# Altium schematic sheet LaunchPad_TargetDevice.SchDoc
size 431 x 279 mm; Date: Not shown in title block; ApprovedBy: Not shown in title block; CheckedBy: Not shown in title block; Author: Not shown in title block; CompanyName: Not shown in title block; Engineer: Not shown in title block; Organization: Not shown in title block; Address1: Not shown in title block; Address2: Not shown in title block; Address3: Not shown in title block; Address4: Not shown in title block; DocumentNumber: 2; Revision: Use project parameter SCH_Rev; SheetNumber: 2; SheetTotal: 3; PageSetup: Record=PageOptions|CenterHorizontal=True|CenterVertical=True|PrintScale=1.00|XCorrection=1.00|YCorrection=1.00|PrintKind=0|BorderSize=5000000|LeftOffset=0|BottomOffset=0|Orientation=2|PaperLength=1000|PaperWidth=1000|Scale=100|PaperSource=15|PrintQuality=600|MediaType=1|DitherType=10|PaperKind=Letter|PrintScaleMode=1; CurrentTime: Not shown in title block; CurrentDate: Not shown in title block; Time: Not shown in title block; DocumentFullPathAndName: Not shown in title block; DocumentName: Not shown in title block; ModifiedDate: Not shown in title block; ImagePath: Not shown in title block
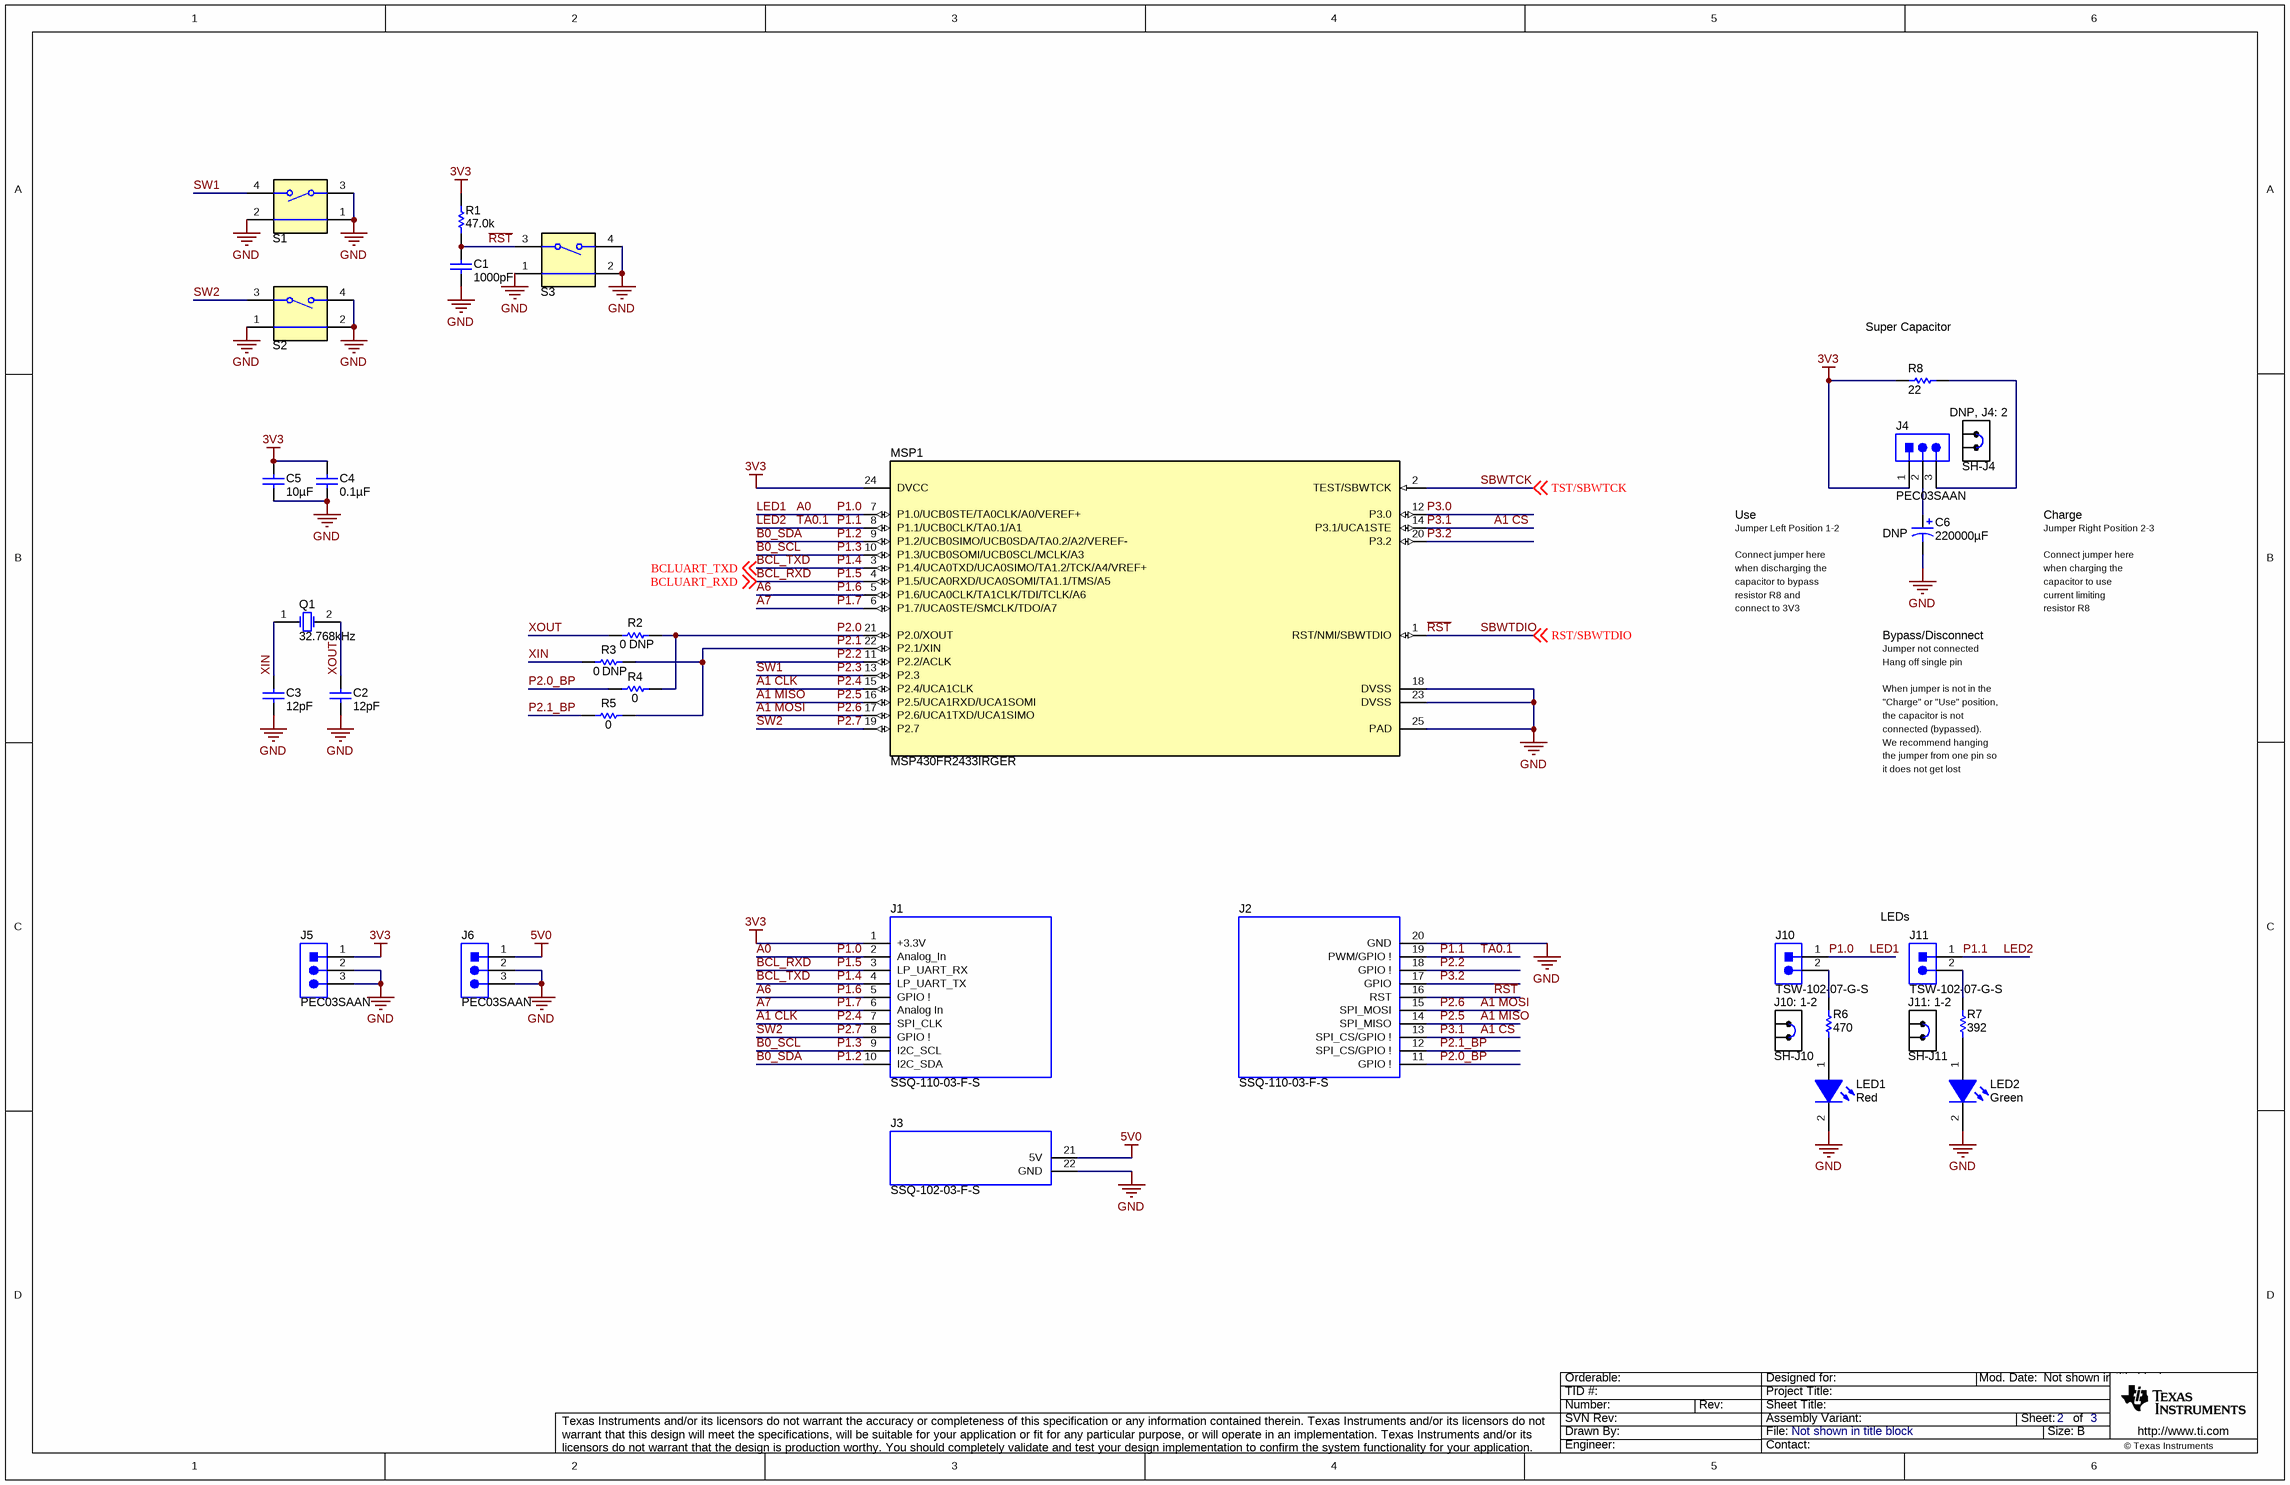
[diagram p0: LaunchPad_TargetDevice.SchDoc]

## Parts
C1  ValueDisplayed: 1000pF  [0402]  (hidden comment: GRM155R71H102KA01D)
C2  ValueDisplayed: 12pF  [0402]  (hidden comment: GRM1555C1E120JA01D)
C3  ValueDisplayed: 12pF  [0402]  (hidden comment: GRM1555C1E120JA01D)
C4  ValueDisplayed: 0.1µF  [0402]  (hidden comment: GRM155R61H104ME14D)
C5  ValueDisplayed: 10µF  [0603]  (hidden comment: GRM188R60J106ME84)
C6  ValueDisplayed: 220000µF  Note: DNP  [SD_1050x600]  (hidden comment: EEC-S0HD224H)
J1  SSQ-110-03-F-S  [BoosterPack_20pin_J1]
J2  SSQ-110-03-F-S  [BoosterPack_20pin_J2]
J3  SSQ-102-03-F-S  [BoosterPack_20pin_J3]
J4  PEC03SAAN  [CONN_PEC03SAAN]
J5  PEC03SAAN  [PEC03SAAN_Launchpad_3V3]
J6  PEC03SAAN  [PEC03SAAN_Launchpad_5V0]
J10  TSW-102-07-G-S  [TSW-102-07-G-S]
J11  TSW-102-07-G-S  [TSW-102-07-G-S]
LED1  value Red  [LED_LTST-C190_Red]  (hidden comment: LTST-C190CKT)
LED2  value Green  [LED_LTST-C190]  (hidden comment: LTST-C190GKT)
MSP1  MSP430FR2433IRGER  [RGE0024H]
Q1  Frequency: 32.768kHz  [Epson_FC-135]  (hidden comment: X1A0001410014)
R1  ValueDisplayed: 47.0k  [0402]  (hidden comment: RC0402FR-0747KL)
R2  ValueDisplayed: 0  Note: DNP  [0603]  (hidden comment: CRCW06030000Z0EA)
R3  ValueDisplayed: 0  Note: DNP  [0603]  (hidden comment: CRCW06030000Z0EA)
R4  ValueDisplayed: 0  [0603]  (hidden comment: CRCW06030000Z0EA)
R5  ValueDisplayed: 0  [0603]  (hidden comment: CRCW06030000Z0EA)
R6  ValueDisplayed: 470  [0402]  (hidden comment: RC0402FR-07470RL)
R7  ValueDisplayed: 392  [0402]  (hidden comment: CRCW0402392RFKED)
R8  ValueDisplayed: 22  [1206]  (hidden comment: CRCW120622R0JNEA)
S1  1188E-1K2-V-TR  [SW_1188E]  (value not drawn)
S2  1188E-1K2-V-TR  [SW_1188E]  (value not drawn)
S3  1188E-1K2-V-TR  [SW_1188E]  (value not drawn)
SH-J4  Note: DNP, J4: 2  [SNT-100-BK-G]  (hidden comment: SNT-100-BK-G)
SH-J10  Note: J10: 1-2  [SNT-100-BK-G]  (hidden comment: SNT-100-BK-G)
SH-J11  Note: J11: 1-2  [SNT-100-BK-G]  (hidden comment: SNT-100-BK-G)

## Nets
3V3: C4.1 C5.2 J1.1(+3.3V) J4.1 J5.1 MSP1.24(DVCC) R1.2 R8.1
5V0: J3.21(5V) J6.1
GND: C1.2 C2.2 C3.2 C4.2 C5.1 C6.2(-) J2.20(GND) J3.22(GND) J5.2 J5.3 J6.2 J6.3 LED1.2(K) LED2.2(K) MSP1.18(DVSS) MSP1.23(DVSS) MSP1.25(PAD) S1.1 S1.2 S1.3 S2.1 S2.2 S2.4 S3.1 S3.2 S3.4
A0: J1.2(Analog_In) J10.1 MSP1.7(P1.0/UCB0STE/TA0CLK/A0/VEREF+)  [also labelled LED1, P1.0]
A1 CLK: J1.7(SPI_CLK) MSP1.15(P2.4/UCA1CLK)  [also labelled P2.4]
A1 CS: J2.13(SPI_CS/GPIO_!) MSP1.14(P3.1/UCA1STE)  [also labelled P3.1]
A1 MISO: J2.14(SPI_MISO) MSP1.16(P2.5/UCA1RXD/UCA1SOMI)  [also labelled P2.5]
A1 MOSI: J2.15(SPI_MOSI) MSP1.17(P2.6/UCA1TXD/UCA1SIMO)  [also labelled P2.6]
A6: J1.5(GPIO_!) MSP1.5(P1.6/UCA0CLK/TA1CLK/TDI/TCLK/A6)  [also labelled P1.6]
A7: J1.6(Analog_In) MSP1.6(P1.7/UCA0STE/SMCLK/TDO/A7)  [also labelled P1.7]
B0_SCL: J1.9(I2C_SCL) MSP1.10(P1.3/UCB0SOMI/UCB0SCL/MCLK/A3)  [also labelled P1.3]
B0_SDA: J1.10(I2C_SDA) MSP1.9(P1.2/UCB0SIMO/UCB0SDA/TA0.2/A2/VEREF-)  [also labelled P1.2]
BCL_RXD: J1.3(LP_UART_RX) MSP1.4(P1.5/UCA0RXD/UCA0SOMI/TA1.1/TMS/A5) ; off-sheet BCLUART_RXD  [also labelled BCLUART_RXD, P1.5]
BCL_TXD: J1.4(LP_UART_TX) MSP1.3(P1.4/UCA0TXD/UCA0SIMO/TA1.2/TCK/A4/VREF+) ; off-sheet BCLUART_TXD  [also labelled BCLUART_TXD, P1.4]
LED2: J2.19(PWM/GPIO_!) J11.1 MSP1.8(P1.1/UCB0CLK/TA0.1/A1)  [also labelled P1.1, TA0.1]
P2.0: MSP1.21(P2.0/XOUT) R2.2 R4.2
P2.0_BP: J2.11(GPIO_!) R4.1
P2.1: MSP1.22(P2.1/XIN) R3.2 R5.2
P2.1_BP: J2.12(SPI_CS/GPIO_!) R5.1
P2.2: J2.18(GPIO_!) MSP1.11(P2.2/ACLK)
P2.3: MSP1.13(P2.3) S1.4  [also labelled SW1]
P2.7: J1.8(GPIO_!) MSP1.19(P2.7) S2.3  [also labelled SW2]
P3.0: MSP1.12(P3.0)
P3.2: J2.17(GPIO) MSP1.20(P3.2)
~{RST}: C1.1 J2.16(RST) MSP1.1(RST/NMI/SBWTDIO) R1.1 S3.3 ; off-sheet RST/SBWTDIO  [also labelled RST/SBWTDIO, SBWTDIO]
SBWTCK: MSP1.2(TEST/SBWTCK) ; off-sheet TST/SBWTCK  [also labelled TST/SBWTCK]
XIN: C3.1 Q1.1(OSC1) R3.1
XOUT: C2.1 Q1.2(OSC2) R2.1
NetC6_1: C6.1(+) J4.2
NetJ4_3: J4.3 R8.2
NetJ10_2: J10.2 R6.2
NetJ11_2: J11.2 R7.2
NetLED1_1: LED1.1(A) R6.1
NetLED2_1: LED2.1(A) R7.1

## Notes on the sheet
- (near R8) Super Capacitor
- Use
- Jumper Left Position 1-2
- Connect jumper here
- when discharging the
- Charge
- Jumper Right Position 2-3
- when charging the
- capacitor to bypass
- resistor R8 and
- connect to 3V3
- Bypass/Disconnect
- capacitor to use
- current limiting
- resistor R8
- Jumper not connected
- When jumper is not in the
- "Charge" or "Use" position,
- Hang off single pin
- the capacitor is not
- connected (bypassed).
- We recommend hanging
- the jumper from one pin so
- it does not get lost
- (near J11) LEDs
- Drawn By:
- SVN Rev:
- Number:
- TID #:
- Orderable:
- Rev:
- Sheet Title:
- File:
- Project Title:
- Designed for:
- Assembly Variant:
- Mod. Date:
- Sheet:
- Size:
- of
- B
- http://www.ti.com
- Texas Instruments and/or its licensors do not warrant the accuracy or completeness of this specification or any information contained therein. Texas Instruments and/or its licensors do not warrant that this design will meet the specifications, will be suitable for your application or fit for any particular purpose, or will operate in an implementation. Texas Instruments and/or its licensors do not warrant that the design is production worthy. You should completely validate and test your design implementation to confirm the system functionality for your application.
- Engineer:
- Contact:
- © Texas Instruments

## Library data of the parts
C1 = GRM155R71H102KA01D: CAP, CERM, 1000 pF, 50 V, +/- 10%, X7R, 0402; Manufacturer: MuRata; Polarized: N; CompType: Capacitor; Value: 1000pF; U/M: EA; Cap_F: 0.000000001; Tolerance_%: 10; Value1: Unknown; VDC_V: 50; Value2: 50V; TaMin_C: -55; TaMax_C: 125; SizeArea_mm2: 0.5; SizeAreaWB_mm2: 3; SizeX_mm: 1; SizeZ_mm: 0.6; AEC Category: Q200; SymbolVersion: 2008-07-09; PartNumber: GRM155R71H102KA01D; PackageReference: 0402; RoHS: Y; MountType: SMT; Technology: Ceramic; TempCo: X7R; Cap_Case: 0402; SizeY_mm: 0.5; Published: 2008-06-19; Publisher: Texas Instruments; LatestRevisionDate: 2017-01-30; ComponentLink1Description: Datasheet link; ComponentLink1URL: http://search.murata.co.jp/Ceramy/PnsearchViewAction.do?HnOFG=ON&HnNFG=ON&SEL_CNT=50&sLang=en&sKey=GRM155R71H102KA01D&x=9&y=9&search=startwith; Supplier 1: Digi-Key; Supplier Part Number 1: 490-1303-1-ND; Supplier 2: Mouser; Supplier Part Number 2: 81-GRM36X102K50; Supplier 3: Farnell; Supplier Part Number 3: 1828882; AEC Qualified: ?
C2 C3 = GRM1555C1E120JA01D: CAP, CERM, 12 pF, 25 V, +/- 5%, C0G/NP0, 0402; Manufacturer: MuRata; Polarized: N; CompType: Capacitor; Value: 12pF; U/M: EA; Cap_F: 0.000000000012; Tolerance_%: 5; Value1: Unknown; VDC_V: 25; Value2: 25V; TaMin_C: -55; TaMax_C: 125; SizeArea_mm2: 0.5; SizeAreaWB_mm2: 3; SizeX_mm: 1; SizeZ_mm: 0.6; AEC Category: Q200; SymbolVersion: 2008-07-09; PartNumber: GRM1555C1E120JA01D; PackageReference: 0402; RoHS: Y; MountType: SMT; Technology: Ceramic; TempCo: C0G/NP0; Cap_Case: 0402; SizeY_mm: 0.5; Published: 2008-06-19; Publisher: Texas Instruments; LatestRevisionDate: 2017-01-30; ComponentLink1Description: Datasheet link; ComponentLink1URL: http://search.murata.co.jp/Ceramy/PnsearchViewAction.do?HnOFG=ON&HnNFG=ON&SEL_CNT=50&sLang=en&sKey=GRM1555C1E120JA01D&x=9&y=9&search=startwith; Supplier 1: Mouser; Supplier Part Number 1: 81-GRM1555C1E120JA1D; AEC Qualified: ?
C4 = GRM155R61H104ME14D: CAP, CERM, 0.1 µF, 50 V, +/- 20%, X5R, 0402; Manufacturer: MuRata; Polarized: N; CompType: Capacitor; Value: 0.1uF; U/M: EA; Cap_F: 0.0000001; Tolerance_%: 20; Value1: Unknown; VDC_V: 50; Value2: 50V; TaMin_C: -55; TaMax_C: 85; SizeArea_mm2: 0.5; SizeAreaWB_mm2: 3; SizeX_mm: 1; SizeZ_mm: 0.6; AEC Category: Q200; SymbolVersion: 2008-07-09; PartNumber: GRM155R61H104ME14D; PackageReference: 0402; RoHS: Y; MountType: SMT; Technology: Ceramic; TempCo: X5R; Cap_Case: 0402; SizeY_mm: 0.5; Published: 2008-06-19; Publisher: Texas Instruments; LatestRevisionDate: 2017-01-30; ComponentLink1Description: Datasheet link; ComponentLink1URL: http://search.murata.co.jp/Ceramy/image/img/A01X/G101/ENG/GRM155R61H104ME14-01.pdf; Supplier 1: Digi-Key; Supplier Part Number 1: GRM155R61H104ME14D-ND; Supplier 2: Mouser; Supplier Part Number 2: 81-GRM155R61H104ME4D; AEC Qualified: N; AEC Grade: N/A
C5 = GRM188R60J106ME84: CAP, CERM, 10 µF, 6.3 V, +/- 20%, X5R, 0603; Manufacturer: MuRata; Polarized: N; CompType: Capacitor; Value: 10uF; U/M: EA; Cap_F: 0.00001; Tolerance_%: 20; Value1: Unknown; VDC_V: 6.3; Value2: 6.3V; TaMin_C: -55; TaMax_C: 85; SizeArea_mm2: 1.28; SizeAreaWB_mm2: 4.68; SizeX_mm: 1.6; SizeY_mm: 0.8; SizeZ_mm: 1; AEC Category: Q200; SymbolVersion: 2008-07-09; PartNumber: GRM188R60J106ME84; PackageReference: 0603; RoHS: Y; MountType: SMT; Technology: Ceramic; TempCo: X5R; Cap_Case: 0603; Published: 2008-06-19; Publisher: Texas Instruments; LatestRevisionDate: 2017-01-30; ComponentLink1Description: Datasheet link; ComponentLink1URL: http://search.murata.co.jp/Ceramy/image/img/A01X/G101/ENG/GRM188R60J106ME84-01.pdf; Supplier 1: Digi-Key; Supplier Part Number 1: 490-7316-1-ND; AEC Qualified: ?
C6 = EEC-S0HD224H: CAP, Electric Double Layer, 220000 µF, 5.5 V, +80/-20%, TH; Manufacturer: Panasonic; Polarized: Y; CompType: Capacitor; Value: 220000uF; U/M: EA; Cap_F: 0.22; Tolerance_%: 80; Value1: Unknown; VDC_V: 5.5; Value2: 5.5V; TaMin_C: -25; TaMax_C: 75; Cap_Case: 10.5x6mm; SizeAreaWB_mm2: 168.75; SizeArea_mm2: 120.75; SizeX_mm: 11.5; SizeY_mm: 10.5; SizeZ_mm: 6; AEC Category: Q200; AEC Qualified: N; SymbolVersion: 2008-07-09; PartNumber: EEC-S0HD224H; PackageReference: D10.5xL6mm; RoHS: Y; MountType: TH; Technology: Electric Double Layer; Series: SD; Publisher: Texas Instruments; LatestRevisionDate: 2017-04-21; ComponentLink1Description: Datasheet link; ComponentLink1URL: https://industrial.panasonic.com/cdbs/www-data/pdf/RDG0000/ABC0000C84.pdf; Supplier 1: Digi-Key; Supplier Part Number 1: P10788-ND; Supplier 2: Newark; Supplier Part Number 2: 96K9371; Supplier 3: Mouser; Supplier Part Number 3: 667-EEC-S0HD224H; AEC Grade: N/A
J1 = BoosterPack_20pin_J1: Receptacle, 2.54mm, 10x1, Gold, TH; Manufacturer: Samtec; Alternate Manufacturer: Major League Electronics; Alternate PartNumber: SSHQ-110-S-08-G-LF; SymbolCreator: a0412235; Note: Booster Pack 20 pin J1; SymbolVersion: 2015-10-21; CompType: Receptacle; PartNumber: SSQ-110-03-F-S; RoHS: Y; PackageReference: 10x1 Receptacle; MountType: TH; ComponentLink1Description: Datasheet Link; Publisher: Texas Instruments; LatestRevisionDate: 2017-03-01; Supplier 1: Farnell; Supplier Part Number 1: 2283783
J2 = BoosterPack_20pin_J2: Receptacle, 2.54mm, 10x1, Gold, TH; Manufacturer: Samtec; Alternate Manufacturer: Major League Electronics; Alternate PartNumber: SSHQ-110-S-08-G-LF; SymbolCreator: a0412235; Note: Booster Pack 20 pin J2; SymbolVersion: 2015-10-21; CompType: Receptacle; PartNumber: SSQ-110-03-F-S; RoHS: Y; PackageReference: 10x1 Receptacle; MountType: TH; ComponentLink1Description: Datasheet Link; Publisher: Texas Instruments; LatestRevisionDate: 2017-03-01; Supplier 1: Farnell; Supplier Part Number 1: 2283783
J3 = BoosterPack_20pin_J3: Receptacle, 2.54mm, 2x1, Gold, TH; Manufacturer: Samtec; SymbolCreator: a0412235; Note: Booster Pack 20 pin J3; SymbolVersion: 2015-10-21; CompType: Receptacle; PartNumber: SSQ-102-03-F-S; RoHS: Y; PackageReference: 2x1 Receptacle; MountType: TH; ComponentLink1Description: Datasheet Link; Publisher: Texas Instruments; LatestRevisionDate: 2017-03-01; Supplier 1: Farnell; Supplier Part Number 1: 2283777
J4 = PEC03SAAN: Header, 100mil, 3x1, Tin, TH; Manufacturer: Sullins Connector Solutions; SymbolCreator: a0412235; Pitch_mm: 2.54; Gender: Male; Shrouded: N; Row_Count: 1; Current_A: 3; Voltage_V: 1800; Cert_UL: Y; SymbolVersion: 2017-03-03; PartNumber: PEC03SAAN; PackageReference: Header, 3 PIN, 100mil, Tin; ClassName: Header; CompType: Header; RoHS: Y; MountType: TH; ComponentLink1Description: Datasheet URL; ComponentLink1URL: http://www.sullinscorp.com/catalogs/77_PAGE108-109_.100_MALE_HDR.pdf; Orientation: Vertical; PinCount: 3; ContactFinish: Tin; Color: Black; Publisher: Texas Instruments; LatestRevisionDate: 2017-04-11; Supplier 1: Digi-Key; Supplier Part Number 1: S1012E-03-ND
J5 J6 = PEC03SAAN: Header, 100mil, 3x1, Tin, TH; Manufacturer: Sullins Connector Solutions; SymbolCreator: a0799628; Pitch_mm: 2.54; Gender: Male; Shrouded: N; Row_Count: 1; Current_A: 3; Voltage_V: 1800; Cert_UL: Y; SymbolVersion: 2013-03-28; PartNumber: PEC03SAAN; PackageReference: Header, 3 PIN, 100mil, Tin; ClassName: Header; CompType: Header; RoHS: Y; MountType: TH; ComponentLink1Description: Datasheet URL; ComponentLink1URL: http://www.sullinscorp.com/catalogs/77_PAGE108-109_.100_MALE_HDR.pdf; Orientation: Vertical; PinCount: 3; ContactFinish: Tin; Color: Black; Publisher: Texas Instruments; LatestRevisionDate: 2017-03-02; Supplier 1: Digi-Key; Supplier Part Number 1: S1012E-03-ND
J10 J11 = TSW-102-07-G-S: Header, 100mil, 2x1, Gold, TH; Manufacturer: Samtec; SymbolCreator: a0412235; Pitch_mm: 2.54; Gender: Male; Shrouded: N; Row_Count: 1; Current_A: 6.3; Voltage_V: 550; Cert_CSA: Y; SymbolVersion: 2013-10-31; PartNumber: TSW-102-07-G-S; PackageReference: 2x1 Header; ClassName: Header; CompType: Header; RoHS: Y; MountType: TH; ComponentLink1Description: Datasheet URL; ComponentLink1URL: http://samtec.com/ftppub/pdf/TSW_TH.PDF; Orientation: Vertical; PinCount: 2; ContactFinish: Gold; Color: Black; Cert_UL: Y; Cert_CULUS: N; Cert_VDE: N; Publisher: Texas Instruments; LatestRevisionDate: 2016-01-07; Supplier 1: Digi-Key; Supplier Part Number 1: SAM1029-02-ND
LED1 = LTST-C190CKT: LED, Red, SMD; Manufacturer: Lite-On; Vf_V: 2; Value2: 2V; Io_A: 0.02; Tjmax_C: 85; Power_TotalModule: 0.0625; Value1: 0.0625W; U/M: EA; SymbolVersion: 2017-01-11; PartNumber: LTST-C190CKT; PackageReference: Red LED, 1.6x0.8x0.8mm; RoHS: Y; CompType: LED; Type: ?; MountType: SMT; Color: red; Published: 2008-07-11; Publisher: Texas Instruments; ComponentLink1URL: http://optoelectronics.liteon.com/en-us/api/DwonloadFileHandler.ashx?txtSpecNo=DS-22-98-0009&txtPartNo=LTST-C190CKT; ComponentLink1Description: Datasheet link; LatestRevisionDate: 2017-02-06; Supplier 1: Digi-Key; Supplier Part Number 1: 160-1181-1-ND; Supplier 2: Mouser; Supplier Part Number 2: 859-LTST-C190CKT
LED2 = LTST-C190GKT: LED, Green, SMD; Manufacturer: Lite-On; Vf_V: 2.1; Value2: 2.1V; Io_A: 0.02; Power_TotalModule: 0.1; Value1: 0.1W; U/M: EA; SymbolVersion: 2017-01-11; PartNumber: LTST-C190GKT; PackageReference: 1.6x0.8x0.8mm; RoHS: Y; CompType: LED; Type: ?; MountType: SMT; Color: green; Published: 2008-07-11; Publisher: Texas Instruments; ComponentLink1URL: https://sps06.itg.ti.com/sites/KMS/crossdivteams/altium/docs/ComponentDatasheets/LTST-C190GKT.pdf; ComponentLink1Description: Datasheet link; LatestRevisionDate: 2017-02-06; Supplier 1: Digi-Key; Supplier Part Number 1: 160-1183-1-ND; Supplier 2: Mouser; Supplier Part Number 2: 859-LTST-C190GKT
MSP1 = MSP430FR2433IRGER: MSP430FR2433 16 MHz Ultra-Low-Power Microcontroller with 16 KB FRAM, 4 KB RAM, 19 IO, 4 Timers, RGE0024H (VQFN-24); Alternate PartNumber: MSP430FR2433IRGET; Manufacturer: Texas Instruments; SymbolCreator: Altium; SizeArea_mm2: 16; SizeAreaWB_mm2: 25; SizeX_mm: 4; SizeZ_mm: 1; CompType: IC; U/M: EA; Note: TI Provided; SymbolVersion: 2015-09-16; PartNumber: MSP430FR2433IRGER; PackageReference: RGE0024H; PackageDescription: VQFN-24; MountType: SMT; SizeY_mm: 4; ComponentLink1Description: Datasheet Link; ComponentLink1URL: http://www.ti.com/lit/ds/symlink/msp430fr2433.pdf; Publisher: Texas Instruments; LatestRevisionDate: 2017-03-06; Alternate Manufacturer: Texas Instruments
Q1 = X1A0001410014: Crystal, 32.768 KHz, 12.5 pF, SMD; Manufacturer: Epson; SymbolCreator: a0412235; U/M: EA; TaMin_C: -40; TaMax_C: 85; Note: Use Exact Part, TI Provided; SymbolVersion: 2008-07-09; PartNumber: X1A0001410014; CompType: Crystal; PackageReference: SMD, 2-Leads, Body 3.2x1.5mm; MountType: SMT; RoHS: Y; ComponentLink1Description: Datasheet Link; ComponentLink1URL: https://support.epson.biz/td/api/doc_check.php?dl=brief_FC-135R_en.pdf; Publisher: Texas Instruments; LatestRevisionDate: 2017-02-02
R1 = RC0402FR-0747KL: RES, 47.0 k, 1%, 0.0625 W, 0402; Manufacturer: Yageo America; CompType: Resistor; Value: 47.0k; Res_ohm: 47000; Value_Code: 47k0; Tolerance_%: 1; Power_W: 0.0625; VDC_V: 50; TempCo: 100 ppm/C; SizeArea_mm2: 0.5; SizeZ_mm: 0.6; U/M: EA; AEC Category: Q200; AEC Qualified: N; SymbolVersion: 2009-05-29; PartNumber: RC0402FR-0747KL; PackageReference: 0402; RoHS: Y; Value1: 1%; Value2: 0.0625W; MountType: SMT; Technology: Thick Film; SizeX_mm: 1; SizeY_mm: 0.5; Published: 2008-06-26; Publisher: Texas Instruments; LatestRevisionDate: 2017-01-28; ComponentLink1Description: Datasheet link; ComponentLink1URL: http://www.yageo.com/documents/recent/PYu-RC0402_51_RoHS_L_6_r.pdf; Supplier 1: Digi-Key; Supplier Part Number 1: 311-47.0KLRCT-ND; Supplier 2: Newark; Supplier Part Number 2: 67R9937; Supplier 3: Mouser; Supplier Part Number 3: 603-RC0402FR-0747KL; AEC Grade: N/A
R2-R5 = CRCW06030000Z0EA: RES, 0, 5%, 0.1 W, 0603; Manufacturer: Vishay-Dale; CompType: Resistor; Value: 0; Value_Code: 0000; Tolerance_%: 5; Power_W: 0.1; Value2: 0.1W; VDC_V: 75; TempCo: 200 ppm/C; SizeArea_mm2: 1.28; SizeX_mm: 1.6; SizeY_mm: 0.8; SizeZ_mm: 1; EIA_Code: E24; U/M: EA; AEC Category: Q200; SymbolVersion: 2009-05-29; PartNumber: CRCW06030000Z0EA; PackageReference: 0603; RoHS: Y; Res_ohm: 0; Value1: 5%; MountType: SMT; Technology: Thick Film; Published: 2008-06-26; Publisher: Texas Instruments; LatestRevisionDate: 2017-03-04; ComponentLink1Description: Datasheet link; ComponentLink1URL: http://www.vishay.com/docs/20035/dcrcwe3.pdf; Supplier 1: Digi-Key; Supplier Part Number 1: 541-0.0GCT-ND; Supplier 2: Newark; Supplier Part Number 2: 52K8014; Supplier 3: Mouser; Supplier Part Number 3: 71-CRCW0603-0-E3; AEC Qualified: ?
R6 = RC0402FR-07470RL: RES, 470, 1%, 0.063 W, 0402; Manufacturer: Yageo America; CompType: Resistor; Value: 470; Value_Code: 470R; Tolerance_%: 1; Power_W: 0.063; Value2: 0.063W; VDC_V: 50; TempCo: 100 ppm/C; SizeArea_mm2: 0.5; SizeZ_mm: 0.6; U/M: EA; AEC Category: Q200; AEC Qualified: N; SymbolVersion: 2009-05-29; PartNumber: RC0402FR-07470RL; PackageReference: 0402; RoHS: Y; Res_ohm: 470; Value1: 1%; MountType: SMT; Technology: Thick Film; SizeX_mm: 1; SizeY_mm: 0.5; Published: 2008-06-26; Publisher: Texas Instruments; LatestRevisionDate: 2017-01-28; ComponentLink1Description: Datasheet link; ComponentLink1URL: http://www.yageo.com/documents/recent/PYu-RC_Group_51_RoHS_L_04.pdf; Supplier 1: Digi-Key; Supplier Part Number 1: 311-470LRCT-ND; Supplier 2: Newark; Supplier Part Number 2: 67R9940; Supplier 3: Mouser; Supplier Part Number 3: 603-RC0402FR-07470RL; AEC Grade: N/A
R7 = CRCW0402392RFKED: RES, 392, 1%, 0.063 W, 0402; Manufacturer: Vishay-Dale; CompType: Resistor; Value: 392; Value_Code: 392R; Tolerance_%: 1; Power_W: 0.063; Value2: 0.063W; VDC_V: 50; TempCo: 100 ppm/C; SizeArea_mm2: 0.5; SizeZ_mm: 0.6; EIA_Code: E96; U/M: EA; AEC Category: Q200; SymbolVersion: 2009-05-29; PartNumber: CRCW0402392RFKED; PackageReference: 0402; RoHS: Y; Res_ohm: 392; Value1: 1%; MountType: SMT; Technology: Thick Film; SizeX_mm: 1; SizeY_mm: 0.5; Published: 2008-06-26; Publisher: Texas Instruments; LatestRevisionDate: 2017-01-28; ComponentLink1Description: Datasheet link; ComponentLink1URL: http://www.vishay.com/docs/20035/dcrcwe3.pdf; Supplier 1: Digi-Key; Supplier Part Number 1: 541-392LCT-ND; Supplier 2: Newark; Supplier Part Number 2: 52K7033; Supplier 3: Mouser; Supplier Part Number 3: 71-CRCW0402-392-E3; AEC Qualified: ?
R8 = CRCW120622R0JNEA: RES, 22, 5%, 0.25 W, 1206; Manufacturer: Vishay-Dale; CompType: Resistor; Value: 22; Value_Code: 22R0; Tolerance_%: 5; Power_W: 0.25; Value2: 0.25W; VDC_V: 200; TempCo: 200 ppm/C; SizeArea_mm2: 5.12; SizeX_mm: 3.2; SizeY_mm: 1.6; SizeZ_mm: 1.35; EIA_Code: E24; U/M: EA; AEC Category: Q200; SymbolVersion: 2009-05-29; PartNumber: CRCW120622R0JNEA; PackageReference: 1206; RoHS: Y; Res_ohm: 22; Value1: 5%; MountType: SMT; Technology: Thick Film; Published: 2008-06-26; Publisher: Texas Instruments; LatestRevisionDate: 2017-04-07; ComponentLink1Description: Datasheet link; ComponentLink1URL: http://www.vishay.com/docs/20035/dcrcwe3.pdf; Supplier 1: Digi-Key; Supplier Part Number 1: 541-22ECT-ND; Supplier 2: Newark; Supplier Part Number 2: 59M6968; Supplier 3: Mouser; Supplier Part Number 3: 71-CRCW1206J-22-E3; AEC Qualified: ?
S1-S3 = 1188E-1K2-V-TR: Switch, SPST, 0.05 A, 12 VDC, SMD; Manufacturer: Diptronics; SymbolCreator: Altium; SizeAreaWB_mm2: 53.9; SizeArea_mm2: 27.3; SizeX_mm: 7.8; SizeY_mm: 3.5; VDC_V: 12; PositionCount: 1; CurrentRating_mA: 50; SymbolVersion: 2017-02-06; PartNumber: 1188E-1K2-V-TR; MountType: SMT; SizeZ_mm: 3.5; ComponentLink1Description: Datasheet URL; ComponentLink1URL: http://www.dip.com.tw/en/en-product-information/en-switch004/item/download/1976_b080c057386714e3a6604cbe658b9df3; RoHS: Y; Circuit: SPST; Orientation: Side Actuated; CompType: Switch; PackageReference: 7.8x3.5mm; Publisher: Texas Instruments; LatestRevisionDate: 2017-02-07
SH-J4 SH-J10 SH-J11 = SNT-100-BK-G: Shunt, 100mil, Gold plated, Black; Manufacturer: Samtec; Alternate Manufacturer: 3M; Alternate PartNumber: 969102-0000-DA; Value: 1x2; ClassName: Shunt; CompType: Shunt; PartNumber: SNT-100-BK-G; RoHS: Y; PackageReference: Shunt; MountType: N/A; ComponentLink1Description: Datasheet Link; ComponentLink1URL: http://www.samtec.com/ftppub/pdf/SNT.PDF; Publisher: Texas Instruments; LatestRevisionDate: 2017-04-21; Supplier 1: Digi-Key; Supplier Part Number 1: SNT-100-BK-G-ND